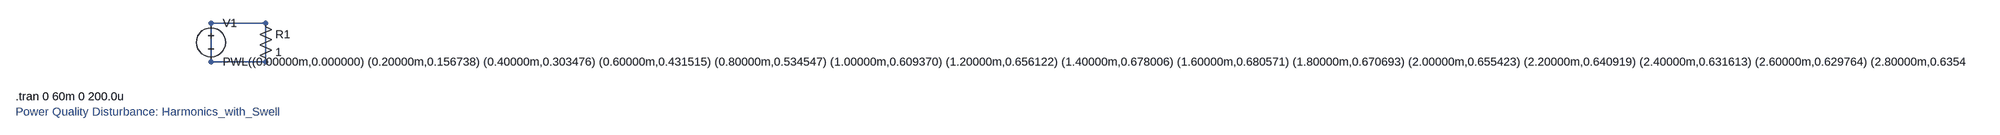
[diagram p0: schematic Harmonics_with_Swell.asc]
Harmonics_with_Swell.asc, the LTspice schematic file:
Version 4
SHEET 1 880 680
WIRE 192 128 80 128
WIRE 80 128 80 208
WIRE 192 208 80 208
WIRE 192 128 192 208
SYMBOL voltage 80 112 R0
WINDOW 123 0 0 Left 0
WINDOW 39 0 0 Left 0
SYMATTR InstName V1
SYMATTR Value PWL((0.00000m,0.000000) (0.20000m,0.156738) (0.40000m,0.303476) (0.60000m,0.431515) (0.80000m,0.534547) (1.00000m,0.609370) (1.20000m,0.656122) (1.40000m,0.678006) (1.60000m,0.680571) (1.80000m,0.670693) (2.00000m,0.655423) (2.20000m,0.640919) (2.40000m,0.631613) (2.60000m,0.629764) (2.80000m,0.635429) (3.00000m,0.646823) (3.20000m,0.660987) (3.40000m,0.674599) (3.60000m,0.684768) (3.80000m,0.689655) (4.00000m,0.688810) (4.20000m,0.683175) (4.40000m,0.674774) (4.60000m,0.666171) (4.80000m,0.659826) (5.00000m,0.657498) (5.20000m,0.659826) (5.40000m,0.666171) (5.60000m,0.674774) (5.80000m,0.683175) (6.00000m,0.688810) (6.20000m,0.689655) (6.40000m,0.684768) (6.60000m,0.674599) (6.80000m,0.660987) (7.00000m,0.646823) (7.20000m,0.635429) (7.40000m,0.629764) (7.60000m,0.631613) (7.80000m,0.640919) (8.00000m,0.655423) (8.20000m,0.670693) (8.40000m,0.680571) (8.60000m,0.678006) (8.80000m,0.656122) (9.00000m,0.609370) (9.20000m,0.534547) (9.40000m,0.431515) (9.60000m,0.303476) (9.80000m,0.156738) (10.00000m,0.000000) (10.20000m,-0.156738) (10.40000m,-0.303476) (10.60000m,-0.431515) (10.80000m,-0.534547) (11.00000m,-0.609370) (11.20000m,-0.656122) (11.40000m,-0.678006) (11.60000m,-0.680571) (11.80000m,-0.670693) (12.00000m,-0.655423) (12.20000m,-0.640919) (12.40000m,-0.631613) (12.60000m,-0.629764) (12.80000m,-0.635429) (13.00000m,-0.646823) (13.20000m,-0.660987) (13.40000m,-0.674599) (13.60000m,-0.684768) (13.80000m,-0.689655) (14.00000m,-0.688810) (14.20000m,-0.683175) (14.40000m,-0.674774) (14.60000m,-0.666171) (14.80000m,-0.659826) (15.00000m,-0.657498) (15.20000m,-0.659826) (15.40000m,-0.666171) (15.60000m,-0.674774) (15.80000m,-0.683175) (16.00000m,-0.688810) (16.20000m,-0.689655) (16.40000m,-0.684768) (16.60000m,-0.674599) (16.80000m,-0.660987) (17.00000m,-0.646823) (17.20000m,-0.635429) (17.40000m,-0.629764) (17.60000m,-0.631613) (17.80000m,-0.640919) (18.00000m,-0.655423) (18.20000m,-0.670693) (18.40000m,-0.680571) (18.60000m,-0.678006) (18.80000m,-0.656122) (19.00000m,-0.609370) (19.20000m,-0.534547) (19.40000m,-0.431515) (19.60000m,-0.303476) (19.80000m,-0.156738) (20.00000m,-0.000000) (20.20000m,0.227270) (20.40000m,0.440040) (20.60000m,0.625697) (20.80000m,0.775093) (21.00000m,0.883587) (21.20000m,0.951377) (21.40000m,0.983108) (21.60000m,0.986828) (21.80000m,0.972504) (22.00000m,0.950364) (22.20000m,0.929332) (22.40000m,0.915838) (22.60000m,0.913158) (22.80000m,0.921372) (23.00000m,0.937893) (23.20000m,0.958431) (23.40000m,0.978169) (23.60000m,0.992914) (23.80000m,1.000000) (24.00000m,0.998774) (24.20000m,0.990603) (24.40000m,0.978422) (24.60000m,0.965947) (24.80000m,0.956747) (25.00000m,0.953372) (25.20000m,0.956747) (25.40000m,0.965947) (25.60000m,0.978422) (25.80000m,0.990603) (26.00000m,0.998774) (26.20000m,1.000000) (26.40000m,0.992914) (26.60000m,0.978169) (26.80000m,0.958431) (27.00000m,0.937893) (27.20000m,0.921372) (27.40000m,0.913158) (27.60000m,0.915838) (27.80000m,0.929332) (28.00000m,0.950364) (28.20000m,0.972504) (28.40000m,0.986828) (28.60000m,0.983108) (28.80000m,0.951377) (29.00000m,0.883587) (29.20000m,0.775093) (29.40000m,0.625697) (29.60000m,0.440040) (29.80000m,0.227270) (30.00000m,0.000000) (30.20000m,-0.227270) (30.40000m,-0.440040) (30.60000m,-0.625697) (30.80000m,-0.775093) (31.00000m,-0.883587) (31.20000m,-0.951377) (31.40000m,-0.983108) (31.60000m,-0.986828) (31.80000m,-0.972504) (32.00000m,-0.950364) (32.20000m,-0.929332) (32.40000m,-0.915838) (32.60000m,-0.913158) (32.80000m,-0.921372) (33.00000m,-0.937893) (33.20000m,-0.958431) (33.40000m,-0.978169) (33.60000m,-0.992914) (33.80000m,-1.000000) (34.00000m,-0.998774) (34.20000m,-0.990603) (34.40000m,-0.978422) (34.60000m,-0.965947) (34.80000m,-0.956747) (35.00000m,-0.953372) (35.20000m,-0.956747) (35.40000m,-0.965947) (35.60000m,-0.978422) (35.80000m,-0.990603) (36.00000m,-0.998774) (36.20000m,-1.000000) (36.40000m,-0.992914) (36.60000m,-0.978169) (36.80000m,-0.958431) (37.00000m,-0.937893) (37.20000m,-0.921372) (37.40000m,-0.913158) (37.60000m,-0.915838) (37.80000m,-0.929332) (38.00000m,-0.950364) (38.20000m,-0.972504) (38.40000m,-0.986828) (38.60000m,-0.983108) (38.80000m,-0.951377) (39.00000m,-0.883587) (39.20000m,-0.775093) (39.40000m,-0.625697) (39.60000m,-0.440040) (39.80000m,-0.227270) (40.00000m,-0.000000) (40.20000m,0.156738) (40.40000m,0.303476) (40.60000m,0.431515) (40.80000m,0.534547) (41.00000m,0.609370) (41.20000m,0.656122) (41.40000m,0.678006) (41.60000m,0.680571) (41.80000m,0.670693) (42.00000m,0.655423) (42.20000m,0.640919) (42.40000m,0.631613) (42.60000m,0.629764) (42.80000m,0.635429) (43.00000m,0.646823) (43.20000m,0.660987) (43.40000m,0.674599) (43.60000m,0.684768) (43.80000m,0.689655) (44.00000m,0.688810) (44.20000m,0.683175) (44.40000m,0.674774) (44.60000m,0.666171) (44.80000m,0.659826) (45.00000m,0.657498) (45.20000m,0.659826) (45.40000m,0.666171) (45.60000m,0.674774) (45.80000m,0.683175) (46.00000m,0.688810) (46.20000m,0.689655) (46.40000m,0.684768) (46.60000m,0.674599) (46.80000m,0.660987) (47.00000m,0.646823) (47.20000m,0.635429) (47.40000m,0.629764) (47.60000m,0.631613) (47.80000m,0.640919) (48.00000m,0.655423) (48.20000m,0.670693) (48.40000m,0.680571) (48.60000m,0.678006) (48.80000m,0.656122) (49.00000m,0.609370) (49.20000m,0.534547) (49.40000m,0.431515) (49.60000m,0.303476) (49.80000m,0.156738) (50.00000m,0.000000) (50.20000m,-0.156738) (50.40000m,-0.303476) (50.60000m,-0.431515) (50.80000m,-0.534547) (51.00000m,-0.609370) (51.20000m,-0.656122) (51.40000m,-0.678006) (51.60000m,-0.680571) (51.80000m,-0.670693) (52.00000m,-0.655423) (52.20000m,-0.640919) (52.40000m,-0.631613) (52.60000m,-0.629764) (52.80000m,-0.635429) (53.00000m,-0.646823) (53.20000m,-0.660987) (53.40000m,-0.674599) (53.60000m,-0.684768) (53.80000m,-0.689655) (54.00000m,-0.688810) (54.20000m,-0.683175) (54.40000m,-0.674774) (54.60000m,-0.666171) (54.80000m,-0.659826) (55.00000m,-0.657498) (55.20000m,-0.659826) (55.40000m,-0.666171) (55.60000m,-0.674774) (55.80000m,-0.683175) (56.00000m,-0.688810) (56.20000m,-0.689655) (56.40000m,-0.684768) (56.60000m,-0.674599) (56.80000m,-0.660987) (57.00000m,-0.646823) (57.20000m,-0.635429) (57.40000m,-0.629764) (57.60000m,-0.631613) (57.80000m,-0.640919) (58.00000m,-0.655423) (58.20000m,-0.670693) (58.40000m,-0.680571) (58.60000m,-0.678006) (58.80000m,-0.656122) (59.00000m,-0.609370) (59.20000m,-0.534547) (59.40000m,-0.431515) (59.60000m,-0.303476) (59.80000m,-0.156738))
SYMBOL res 176 112 R0
SYMATTR InstName R1
SYMATTR Value 1
TEXT -320 280 Left 2 !.tran 0 60m 0 200.0u
TEXT -320 312 Left 2 ;Power Quality Disturbance: Harmonics_with_Swell

The netlist it stands for:
* Harmonics_with_Swell.asc
V1 N001 N001 PWL((0.00000m,0.000000) (0.20000m,0.156738) (0.40000m,0.303476) (0.60000m,0.431515) (0.80000m,0.534547) (1.00000m,0.609370) (1.20000m,0.656122) (1.40000m,0.678006) (1.60000m,0.680571) (1.80000m,0.670693) (2.00000m,0.655423) (2.20000m,0.640919) (2.40000m,0.631613) (2.60000m,0.629764) (2.80000m,0.635429) (3.00000m,0.646823) (3.20000m,0.660987) (3.40000m,0.674599) (3.60000m,0.684768) (3.80000m,0.689655) (4.00000m,0.688810) (4.20000m,0.683175) (4.40000m,0.674774) (4.60000m,0.666171) (4.80000m,0.659826) (5.00000m,0.657498) (5.20000m,0.659826) (5.40000m,0.666171) (5.60000m,0.674774) (5.80000m,0.683175) (6.00000m,0.688810) (6.20000m,0.689655) (6.40000m,0.684768) (6.60000m,0.674599) (6.80000m,0.660987) (7.00000m,0.646823) (7.20000m,0.635429) (7.40000m,0.629764) (7.60000m,0.631613) (7.80000m,0.640919) (8.00000m,0.655423) (8.20000m,0.670693) (8.40000m,0.680571) (8.60000m,0.678006) (8.80000m,0.656122) (9.00000m,0.609370) (9.20000m,0.534547) (9.40000m,0.431515) (9.60000m,0.303476) (9.80000m,0.156738) (10.00000m,0.000000) (10.20000m,-0.156738) (10.40000m,-0.303476) (10.60000m,-0.431515) (10.80000m,-0.534547) (11.00000m,-0.609370) (11.20000m,-0.656122) (11.40000m,-0.678006) (11.60000m,-0.680571) (11.80000m,-0.670693) (12.00000m,-0.655423) (12.20000m,-0.640919) (12.40000m,-0.631613) (12.60000m,-0.629764) (12.80000m,-0.635429) (13.00000m,-0.646823) (13.20000m,-0.660987) (13.40000m,-0.674599) (13.60000m,-0.684768) (13.80000m,-0.689655) (14.00000m,-0.688810) (14.20000m,-0.683175) (14.40000m,-0.674774) (14.60000m,-0.666171) (14.80000m,-0.659826) (15.00000m,-0.657498) (15.20000m,-0.659826) (15.40000m,-0.666171) (15.60000m,-0.674774) (15.80000m,-0.683175) (16.00000m,-0.688810) (16.20000m,-0.689655) (16.40000m,-0.684768) (16.60000m,-0.674599) (16.80000m,-0.660987) (17.00000m,-0.646823) (17.20000m,-0.635429) (17.40000m,-0.629764) (17.60000m,-0.631613) (17.80000m,-0.640919) (18.00000m,-0.655423) (18.20000m,-0.670693) (18.40000m,-0.680571) (18.60000m,-0.678006) (18.80000m,-0.656122) (19.00000m,-0.609370) (19.20000m,-0.534547) (19.40000m,-0.431515) (19.60000m,-0.303476) (19.80000m,-0.156738) (20.00000m,-0.000000) (20.20000m,0.227270) (20.40000m,0.440040) (20.60000m,0.625697) (20.80000m,0.775093) (21.00000m,0.883587) (21.20000m,0.951377) (21.40000m,0.983108) (21.60000m,0.986828) (21.80000m,0.972504) (22.00000m,0.950364) (22.20000m,0.929332) (22.40000m,0.915838) (22.60000m,0.913158) (22.80000m,0.921372) (23.00000m,0.937893) (23.20000m,0.958431) (23.40000m,0.978169) (23.60000m,0.992914) (23.80000m,1.000000) (24.00000m,0.998774) (24.20000m,0.990603) (24.40000m,0.978422) (24.60000m,0.965947) (24.80000m,0.956747) (25.00000m,0.953372) (25.20000m,0.956747) (25.40000m,0.965947) (25.60000m,0.978422) (25.80000m,0.990603) (26.00000m,0.998774) (26.20000m,1.000000) (26.40000m,0.992914) (26.60000m,0.978169) (26.80000m,0.958431) (27.00000m,0.937893) (27.20000m,0.921372) (27.40000m,0.913158) (27.60000m,0.915838) (27.80000m,0.929332) (28.00000m,0.950364) (28.20000m,0.972504) (28.40000m,0.986828) (28.60000m,0.983108) (28.80000m,0.951377) (29.00000m,0.883587) (29.20000m,0.775093) (29.40000m,0.625697) (29.60000m,0.440040) (29.80000m,0.227270) (30.00000m,0.000000) (30.20000m,-0.227270) (30.40000m,-0.440040) (30.60000m,-0.625697) (30.80000m,-0.775093) (31.00000m,-0.883587) (31.20000m,-0.951377) (31.40000m,-0.983108) (31.60000m,-0.986828) (31.80000m,-0.972504) (32.00000m,-0.950364) (32.20000m,-0.929332) (32.40000m,-0.915838) (32.60000m,-0.913158) (32.80000m,-0.921372) (33.00000m,-0.937893) (33.20000m,-0.958431) (33.40000m,-0.978169) (33.60000m,-0.992914) (33.80000m,-1.000000) (34.00000m,-0.998774) (34.20000m,-0.990603) (34.40000m,-0.978422) (34.60000m,-0.965947) (34.80000m,-0.956747) (35.00000m,-0.953372) (35.20000m,-0.956747) (35.40000m,-0.965947) (35.60000m,-0.978422) (35.80000m,-0.990603) (36.00000m,-0.998774) (36.20000m,-1.000000) (36.40000m,-0.992914) (36.60000m,-0.978169) (36.80000m,-0.958431) (37.00000m,-0.937893) (37.20000m,-0.921372) (37.40000m,-0.913158) (37.60000m,-0.915838) (37.80000m,-0.929332) (38.00000m,-0.950364) (38.20000m,-0.972504) (38.40000m,-0.986828) (38.60000m,-0.983108) (38.80000m,-0.951377) (39.00000m,-0.883587) (39.20000m,-0.775093) (39.40000m,-0.625697) (39.60000m,-0.440040) (39.80000m,-0.227270) (40.00000m,-0.000000) (40.20000m,0.156738) (40.40000m,0.303476) (40.60000m,0.431515) (40.80000m,0.534547) (41.00000m,0.609370) (41.20000m,0.656122) (41.40000m,0.678006) (41.60000m,0.680571) (41.80000m,0.670693) (42.00000m,0.655423) (42.20000m,0.640919) (42.40000m,0.631613) (42.60000m,0.629764) (42.80000m,0.635429) (43.00000m,0.646823) (43.20000m,0.660987) (43.40000m,0.674599) (43.60000m,0.684768) (43.80000m,0.689655) (44.00000m,0.688810) (44.20000m,0.683175) (44.40000m,0.674774) (44.60000m,0.666171) (44.80000m,0.659826) (45.00000m,0.657498) (45.20000m,0.659826) (45.40000m,0.666171) (45.60000m,0.674774) (45.80000m,0.683175) (46.00000m,0.688810) (46.20000m,0.689655) (46.40000m,0.684768) (46.60000m,0.674599) (46.80000m,0.660987) (47.00000m,0.646823) (47.20000m,0.635429) (47.40000m,0.629764) (47.60000m,0.631613) (47.80000m,0.640919) (48.00000m,0.655423) (48.20000m,0.670693) (48.40000m,0.680571) (48.60000m,0.678006) (48.80000m,0.656122) (49.00000m,0.609370) (49.20000m,0.534547) (49.40000m,0.431515) (49.60000m,0.303476) (49.80000m,0.156738) (50.00000m,0.000000) (50.20000m,-0.156738) (50.40000m,-0.303476) (50.60000m,-0.431515) (50.80000m,-0.534547) (51.00000m,-0.609370) (51.20000m,-0.656122) (51.40000m,-0.678006) (51.60000m,-0.680571) (51.80000m,-0.670693) (52.00000m,-0.655423) (52.20000m,-0.640919) (52.40000m,-0.631613) (52.60000m,-0.629764) (52.80000m,-0.635429) (53.00000m,-0.646823) (53.20000m,-0.660987) (53.40000m,-0.674599) (53.60000m,-0.684768) (53.80000m,-0.689655) (54.00000m,-0.688810) (54.20000m,-0.683175) (54.40000m,-0.674774) (54.60000m,-0.666171) (54.80000m,-0.659826) (55.00000m,-0.657498) (55.20000m,-0.659826) (55.40000m,-0.666171) (55.60000m,-0.674774) (55.80000m,-0.683175) (56.00000m,-0.688810) (56.20000m,-0.689655) (56.40000m,-0.684768) (56.60000m,-0.674599) (56.80000m,-0.660987) (57.00000m,-0.646823) (57.20000m,-0.635429) (57.40000m,-0.629764) (57.60000m,-0.631613) (57.80000m,-0.640919) (58.00000m,-0.655423) (58.20000m,-0.670693) (58.40000m,-0.680571) (58.60000m,-0.678006) (58.80000m,-0.656122) (59.00000m,-0.609370) (59.20000m,-0.534547) (59.40000m,-0.431515) (59.60000m,-0.303476) (59.80000m,-0.156738))
R1 N001 N001 1
.tran 0 60m 0 200.0u
* Power Quality Disturbance: Harmonics_with_Swell
.backanno
.end